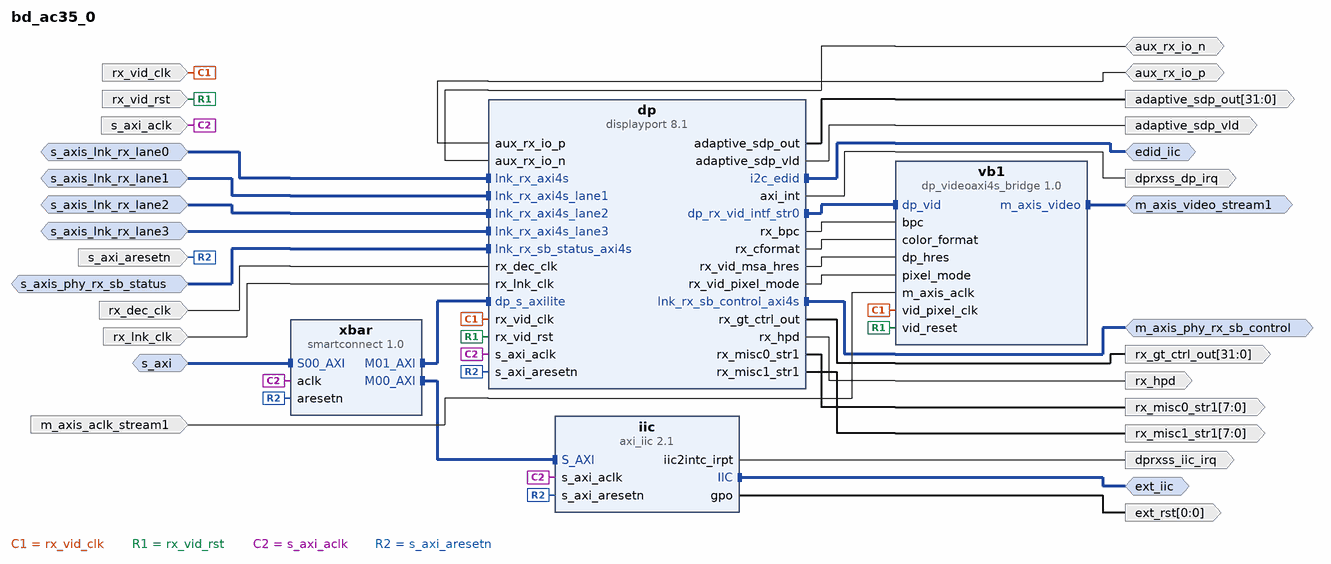
[diagram p0: block diagram of the top level]
# Vivado block design bd_ac35_0, xcvc1902-vsva2197-2MP-e-S, Vivado 2023.2
create_bd_design bd_ac35_0

create_bd_intf_port -mode Slave -vlnv xilinx.com:interface:aximm_rtl:1.0 s_axi
set_property -dict [list \
  CONFIG.DATA_WIDTH 32 \
  CONFIG.NUM_READ_OUTSTANDING 1 \
  CONFIG.NUM_WRITE_OUTSTANDING 1 \
  CONFIG.PROTOCOL AXI4LITE \
  CONFIG.master_id 1 \
] [get_bd_intf_ports s_axi]
create_bd_intf_port -mode Slave -vlnv xilinx.com:interface:axis_rtl:1.0 s_axis_phy_rx_sb_status
create_bd_intf_port -mode Master -vlnv xilinx.com:interface:axis_rtl:1.0 m_axis_phy_rx_sb_control
create_bd_intf_port -mode Slave -vlnv xilinx.com:interface:axis_rtl:1.0 s_axis_lnk_rx_lane0
create_bd_intf_port -mode Slave -vlnv xilinx.com:interface:axis_rtl:1.0 s_axis_lnk_rx_lane1
create_bd_intf_port -mode Slave -vlnv xilinx.com:interface:axis_rtl:1.0 s_axis_lnk_rx_lane2
create_bd_intf_port -mode Slave -vlnv xilinx.com:interface:axis_rtl:1.0 s_axis_lnk_rx_lane3
create_bd_intf_port -mode Master -vlnv xilinx.com:interface:iic_rtl:1.0 edid_iic
create_bd_intf_port -mode Master -vlnv xilinx.com:interface:axis_rtl:1.0 m_axis_video_stream1
set_property -dict {CONFIG.HAS_TKEEP 0} [get_bd_intf_ports m_axis_video_stream1]
create_bd_intf_port -mode Master -vlnv xilinx.com:interface:iic_rtl:1.0 ext_iic
create_bd_port -dir I -type clk s_axi_aclk
set_property -dict [list \
  CONFIG.ASSOCIATED_BUSIF m_axis_phy_rx_sb_control:s_axi:s_axis_phy_rx_sb_status \
  CONFIG.ASSOCIATED_RESET s_axi_aresetn \
] [get_bd_ports s_axi_aclk]
create_bd_port -dir I -type rst s_axi_aresetn
set_property -dict {CONFIG.POLARITY ACTIVE_LOW} [get_bd_ports s_axi_aresetn]
create_bd_port -dir I -type clk rx_vid_clk
set_property -dict {CONFIG.ASSOCIATED_RESET rx_vid_rst} [get_bd_ports rx_vid_clk]
create_bd_port -dir I -type rst rx_vid_rst
set_property -dict {CONFIG.POLARITY ACTIVE_HIGH} [get_bd_ports rx_vid_rst]
create_bd_port -dir I -type clk m_axis_aclk_stream1
create_bd_port -dir IO aux_rx_io_p
create_bd_port -dir IO aux_rx_io_n
create_bd_port -dir I -type clk rx_dec_clk
create_bd_port -dir I -type clk rx_lnk_clk
set_property -dict [list \
  CONFIG.ASSOCIATED_BUSIF s_axis_lnk_rx_lane0:s_axis_lnk_rx_lane1:s_axis_lnk_rx_lane2:s_axis_lnk_rx_lane3 \
] [get_bd_ports rx_lnk_clk]
create_bd_port -dir O -type data rx_hpd
create_bd_port -dir O -type intr dprxss_dp_irq
create_bd_port -dir O -from 31 -to 0 rx_gt_ctrl_out
create_bd_port -dir O -from 7 -to 0 rx_misc0_str1
create_bd_port -dir O -from 7 -to 0 rx_misc1_str1
create_bd_port -dir O -from 31 -to 0 adaptive_sdp_out
create_bd_port -dir O -type data adaptive_sdp_vld
create_bd_port -dir O -from 0 -to 0 ext_rst
create_bd_port -dir O -type intr dprxss_iic_irq

create_bd_cell -type ip -vlnv xilinx.com:ip:displayport:8.1 dp
set_property -dict [list \
  CONFIG.C_VERSAL true \
  CONFIG.Data_flow_direction Receive_Sink_Core \
  CONFIG.ENABLE_8B10B_DEC true \
  CONFIG.ENABLE_DSC 0 \
  CONFIG.Enable_HDCP22_Encryption_Hooks false \
  CONFIG.Enable_HDCP_Encryption_Hooks false \
  CONFIG.Enable_of_Audio_Channels false \
  CONFIG.GT_Data_Width 2 \
  CONFIG.INCLUDE_CLK_RECOV_SUPPORT 0 \
  CONFIG.INCLUDE_FEC_PORTS 0 \
  CONFIG.INCLUDE_VID_EDID 0 \
  CONFIG.Link_Rate 5.4 \
  CONFIG.MST_Enable false \
  CONFIG.Max_Bits_Per_Color 8 \
  CONFIG.Number_of_Audio_Channels 2 \
  CONFIG.Number_of_Lanes 4 \
  CONFIG.PHY_type_External External_phy \
  CONFIG.Protocol_Selection DP_1_3 \
  CONFIG.Quad_Pixel_Enable true \
  CONFIG.SIM_Mode false \
  CONFIG.SS_Mode true \
  CONFIG.YCRCB_Enable true \
  CONFIG.YOnly_Enable true \
  CONFIG.aux_io_loc 0 \
  CONFIG.aux_io_type 0 \
  CONFIG.eDP_Enable false \
] [get_bd_cells dp]
create_bd_cell -type ip -vlnv xilinx.com:ip:axi_iic:2.1 iic
set_property -dict {CONFIG.IIC_FREQ_KHZ 400} [get_bd_cells iic]
create_bd_cell -type ip -vlnv xilinx.com:ip:smartconnect:1.0 xbar
set_property -dict {CONFIG.NUM_MI 2 CONFIG.NUM_SI 1} [get_bd_cells xbar]
create_bd_cell -type ip -vlnv xilinx.com:ip:dp_videoaxi4s_bridge:1.0 vb1
set_property -dict [list \
  CONFIG.C_ENABLE_420_FOR_MAX_8k30 false \
  CONFIG.C_ENABLE_420_FOR_MAX_8k60 false \
  CONFIG.C_ENABLE_DSC false \
  CONFIG.C_ENABLE_DSC_DUMMY_BYTES_IN_RX false \
  CONFIG.C_ENABLE_INTERNAL_REMAP true \
  CONFIG.C_MAX_BPC 8 \
  CONFIG.C_M_AXIS_VIDEO_TDATA_WIDTH 96 \
  CONFIG.C_M_AXIS_VIDEO_TDATA_WIDTH_BRIDGE_OUTPUT 96 \
  CONFIG.C_PPC 4 \
  CONFIG.C_START_DSC_BYTE_FROM_LSB true \
  CONFIG.C_UG934_COMPLIANCE true \
] [get_bd_cells vb1]

# ---- connections ----

connect_bd_intf_net [get_bd_intf_pins dp/dp_rx_vid_intf_str0] [get_bd_intf_pins vb1/dp_vid]
connect_bd_intf_net [get_bd_intf_pins dp/i2c_edid] [get_bd_intf_ports edid_iic]
connect_bd_intf_net [get_bd_intf_pins dp/lnk_rx_sb_control_axi4s] [get_bd_intf_ports m_axis_phy_rx_sb_control]
connect_bd_intf_net [get_bd_intf_pins iic/IIC] [get_bd_intf_ports ext_iic]
connect_bd_intf_net [get_bd_intf_ports s_axi] [get_bd_intf_pins xbar/S00_AXI]
connect_bd_intf_net -intf_net s_axis_lnk_rx_lane0_1 [get_bd_intf_pins dp/lnk_rx_axi4s] [get_bd_intf_ports s_axis_lnk_rx_lane0]
connect_bd_intf_net -intf_net s_axis_lnk_rx_lane1_1 [get_bd_intf_pins dp/lnk_rx_axi4s_lane1] [get_bd_intf_ports s_axis_lnk_rx_lane1]
connect_bd_intf_net -intf_net s_axis_lnk_rx_lane2_1 [get_bd_intf_pins dp/lnk_rx_axi4s_lane2] [get_bd_intf_ports s_axis_lnk_rx_lane2]
connect_bd_intf_net -intf_net s_axis_lnk_rx_lane3_1 [get_bd_intf_pins dp/lnk_rx_axi4s_lane3] [get_bd_intf_ports s_axis_lnk_rx_lane3]
connect_bd_intf_net [get_bd_intf_pins dp/lnk_rx_sb_status_axi4s] [get_bd_intf_ports s_axis_phy_rx_sb_status]
connect_bd_intf_net [get_bd_intf_pins vb1/m_axis_video] [get_bd_intf_ports m_axis_video_stream1]
connect_bd_intf_net [get_bd_intf_pins xbar/M00_AXI] [get_bd_intf_pins iic/S_AXI]
connect_bd_intf_net [get_bd_intf_pins xbar/M01_AXI] [get_bd_intf_pins dp/dp_s_axilite]
connect_bd_net [get_bd_ports aux_rx_io_p] [get_bd_pins dp/aux_rx_io_p]
connect_bd_net [get_bd_ports aux_rx_io_n] [get_bd_pins dp/aux_rx_io_n]
connect_bd_net [get_bd_pins dp/adaptive_sdp_out] [get_bd_ports adaptive_sdp_out]
connect_bd_net [get_bd_pins dp/adaptive_sdp_vld] [get_bd_ports adaptive_sdp_vld]
connect_bd_net [get_bd_pins dp/axi_int] [get_bd_ports dprxss_dp_irq]
connect_bd_net [get_bd_pins dp/rx_bpc] [get_bd_pins vb1/bpc]
connect_bd_net [get_bd_pins dp/rx_cformat] [get_bd_pins vb1/color_format]
connect_bd_net [get_bd_pins dp/rx_gt_ctrl_out] [get_bd_ports rx_gt_ctrl_out]
connect_bd_net [get_bd_pins dp/rx_hpd] [get_bd_ports rx_hpd]
connect_bd_net [get_bd_pins dp/rx_misc0_str1] [get_bd_ports rx_misc0_str1]
connect_bd_net [get_bd_pins dp/rx_misc1_str1] [get_bd_ports rx_misc1_str1]
connect_bd_net [get_bd_pins dp/rx_vid_msa_hres] [get_bd_pins vb1/dp_hres]
connect_bd_net [get_bd_pins dp/rx_vid_pixel_mode] [get_bd_pins vb1/pixel_mode]
connect_bd_net [get_bd_pins iic/gpo] [get_bd_ports ext_rst]
connect_bd_net [get_bd_pins iic/iic2intc_irpt] [get_bd_ports dprxss_iic_irq]
connect_bd_net -net m_axis_aclk_stream1_1 [get_bd_ports m_axis_aclk_stream1] [get_bd_pins vb1/m_axis_aclk]
connect_bd_net [get_bd_ports rx_dec_clk] [get_bd_pins dp/rx_dec_clk]
connect_bd_net [get_bd_ports rx_lnk_clk] [get_bd_pins dp/rx_lnk_clk]
connect_bd_net [get_bd_ports rx_vid_clk] [get_bd_pins dp/rx_vid_clk] [get_bd_pins vb1/vid_pixel_clk]
connect_bd_net [get_bd_ports rx_vid_rst] [get_bd_pins dp/rx_vid_rst] [get_bd_pins vb1/vid_reset]
connect_bd_net [get_bd_ports s_axi_aclk] [get_bd_pins dp/s_axi_aclk] [get_bd_pins iic/s_axi_aclk] [get_bd_pins xbar/aclk]
connect_bd_net [get_bd_ports s_axi_aresetn] [get_bd_pins dp/s_axi_aresetn] [get_bd_pins iic/s_axi_aresetn] [get_bd_pins xbar/aresetn]

# ---- address map ----
assign_bd_address -offset 0x00000000 -range 8K -target_address_space [get_bd_addr_spaces s_axi] [get_bd_addr_segs dp/dp_s_axilite/Reg]
assign_bd_address -offset 0x00002000 -range 4K -target_address_space [get_bd_addr_spaces s_axi] [get_bd_addr_segs iic/S_AXI/Reg]

validate_bd_design
save_bd_design
